# EAGLE design main (EAGLE 7.6.0)
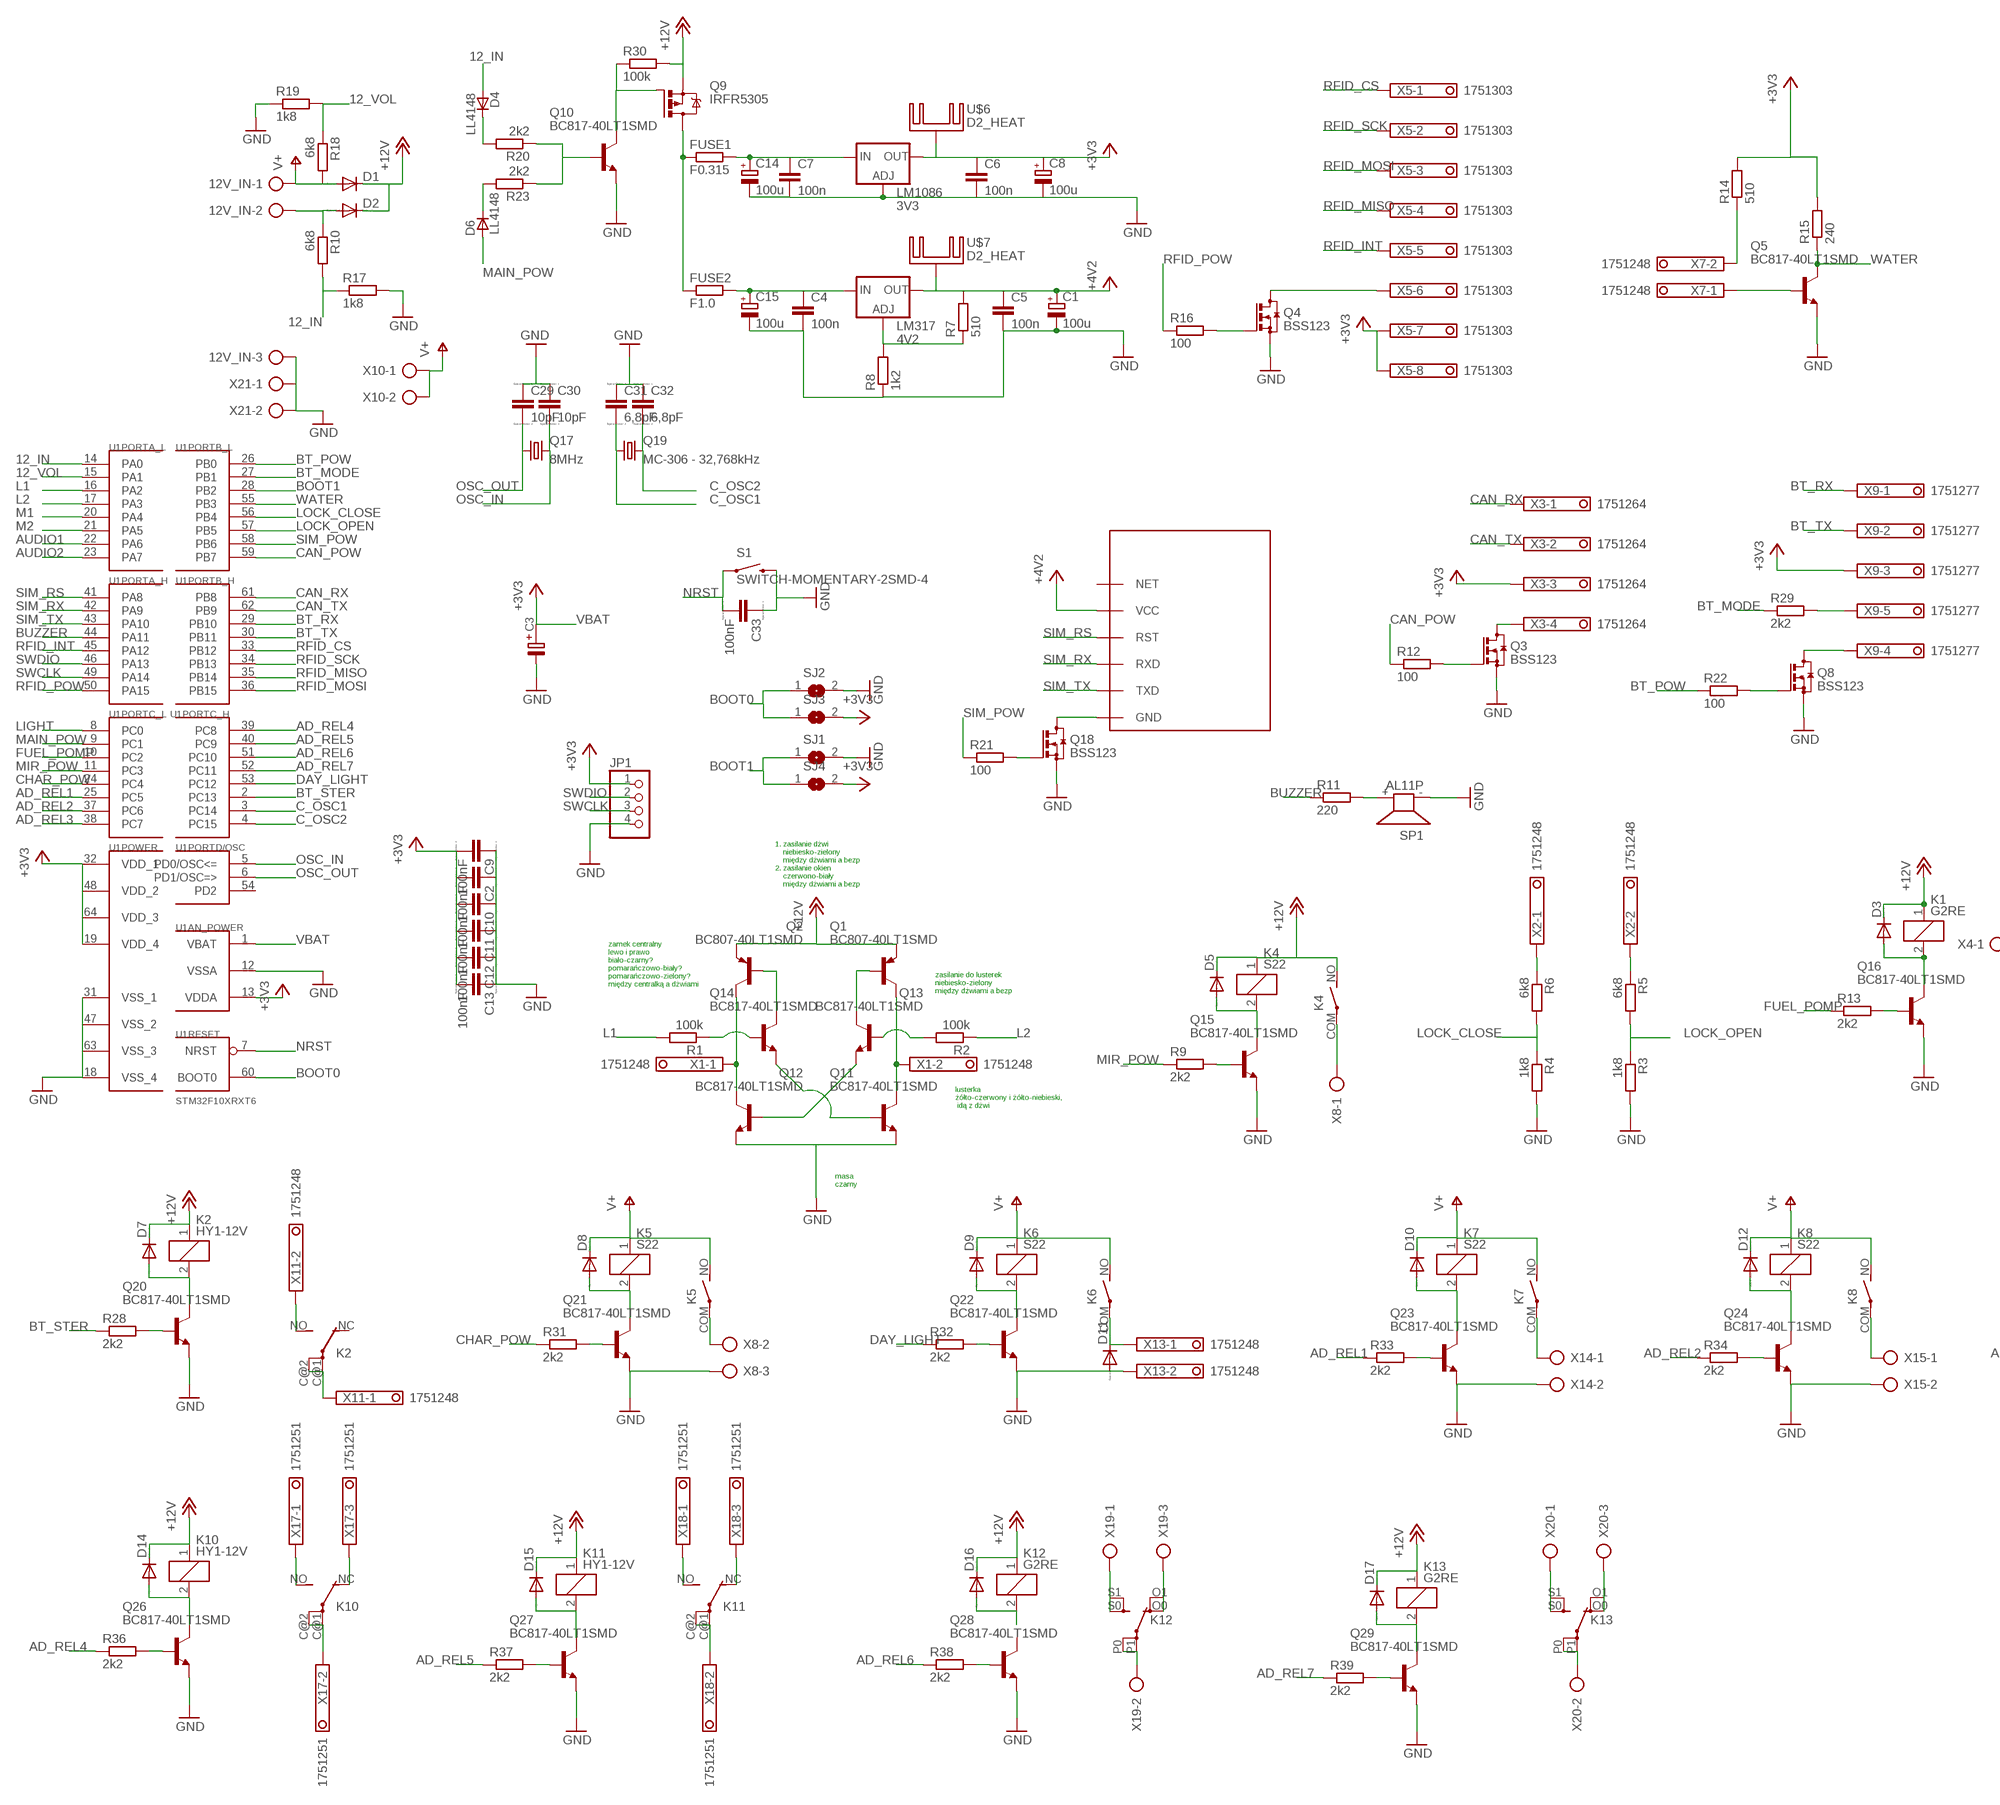
[diagram p0: schematic, sheet 1, part 1 of 2]
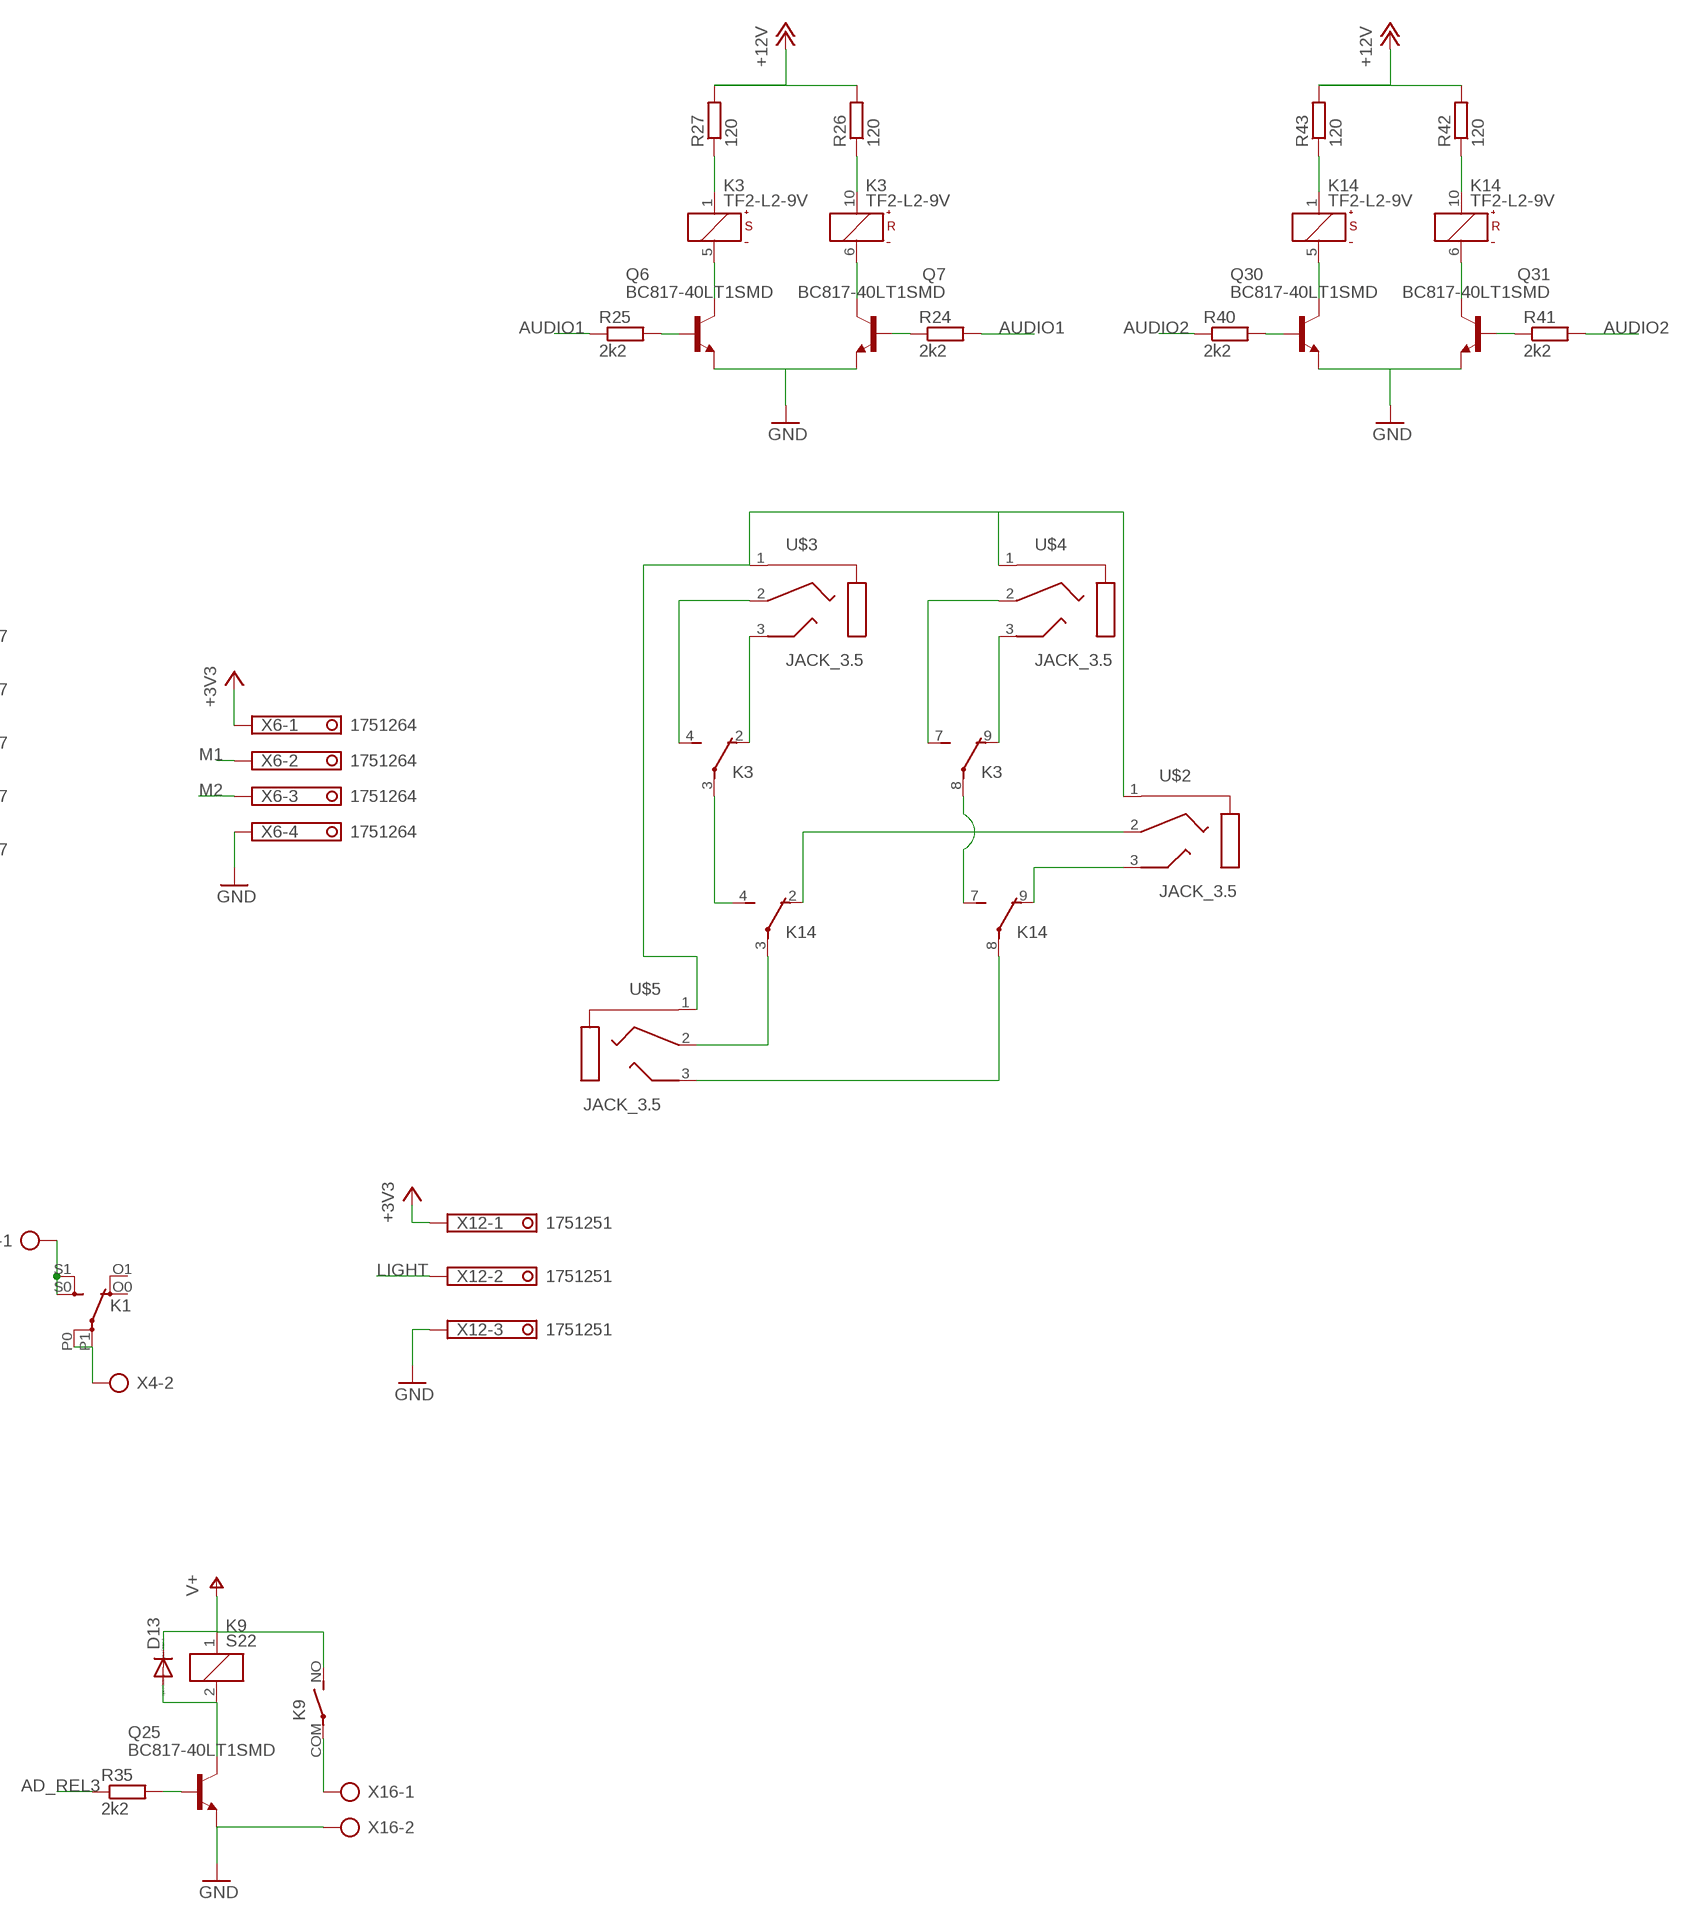
[diagram p1: schematic, sheet 1, part 2 of 2]

## Parts
12V_IN  AK500/3  [AK500/3]
C1  100u  CPOL-EUE2,5-6E  [E2,5-6E]
C2  100nF  CC2012  [C2012]
C3  CAP-13,5  [PAC-G-1]
C4  100n  C-EUC2012  [C2012]
C5  100n  C-EUC2012  [C2012]
C6  100n  C-EUC2012  [C2012]
C7  100n  C-EUC2012  [C2012]
C8  100u  CPOL-EUE2,5-6E  [E2,5-6E]
C9  100nF  CC2012  [C2012]
C10  100nF  CC2012  [C2012]
C11  100nF  CC2012  [C2012]
C12  100nF  CC2012  [C2012]
C13  100nF  CC2012  [C2012]
C14  100u  CPOL-EUE2,5-6E  [E2,5-6E]
C15  100u  CPOL-EUE2,5-6E  [E2,5-6E]
C29  10pF  CC2012  [C2012]
C30  10pF  CC2012  [C2012]
C31  6,8pF  CC2012  [C2012]
C32  6,8pF  CC2012  [C2012]
C33  100nF  CC2012  [C2012]
D1  DIODE-P6-15  [P6-15]
D2  DIODE-P6-15  [P6-15]
D3  DIODE-DO-214AC  [DO-214AC]
D4  LL4148  [SOD80_DO213AA_MINIMELF]
D5  DIODE-DO-214AC  [DO-214AC]
D6  LL4148  [SOD80_DO213AA_MINIMELF]
D7  DIODE-DO-214AC  [DO-214AC]
D8  DIODE-DO-214AC  [DO-214AC]
D9  DIODE-DO-214AC  [DO-214AC]
D10  DIODE-DO-214AC  [DO-214AC]
D11  DIODE-DO-214AC  [DO-214AC]
D12  DIODE-DO-214AC  [DO-214AC]
D13  DIODE-DO-214AC  [DO-214AC]
D14  DIODE-DO-214AC  [DO-214AC]
D15  DIODE-DO-214AC  [DO-214AC]
D16  DIODE-DO-214AC  [DO-214AC]
D17  DIODE-DO-214AC  [DO-214AC]
FUSE1  F0.315  R-EU_R2512  [R2512]
FUSE2  F1.0  R-EU_R2512  [R2512]
JP1  PINHD-1X4  [1X04]
K1  G2RE  [G2RE]
K2  HY1-12V  [HY]
K3  TF2-L2-9V  [TF2]
K4  S22  [LD]
K5  S22  [LD]
K6  S22  [LD]
K7  S22  [LD]
K8  S22  [LD]
K9  S22  [LD]
K10  HY1-12V  [HY]
K11  HY1-12V  [HY]
K12  G2RE  [G2RE]
K13  G2RE  [G2RE]
K14  TF2-L2-9V  [TF2]
LM317  4V2  LM317BD2T  [D2PACK]
LM1086  3V3  LM317BD2T  [D2PACK]
Q1  BC807-40LT1SMD  [SOT23-BEC]
Q2  BC807-40LT1SMD  [SOT23-BEC]
Q3  BSS123  [SOT23]
Q4  BSS123  [SOT23]
Q5  BC817-40LT1SMD  [SOT23-BEC]
Q6  BC817-40LT1SMD  [SOT23-BEC]
Q7  BC817-40LT1SMD  [SOT23-BEC]
Q8  BSS123  [SOT23]
Q9  IRFR5305  [D-PAK_TO252AA]
Q10  BC817-40LT1SMD  [SOT23-BEC]
Q11  BC817-40LT1SMD  [SOT23-BEC]
Q12  BC817-40LT1SMD  [SOT23-BEC]
Q13  BC817-40LT1SMD  [SOT23-BEC]
Q14  BC817-40LT1SMD  [SOT23-BEC]
Q15  BC817-40LT1SMD  [SOT23-BEC]
Q16  BC817-40LT1SMD  [SOT23-BEC]
Q17  8MHz  CRYSTALHC49UP  [HC49UP]
Q18  BSS123  [SOT23]
Q19  MC-306 - 32,768kHz  MC-306  [MC-306]
Q20  BC817-40LT1SMD  [SOT23-BEC]
Q21  BC817-40LT1SMD  [SOT23-BEC]
Q22  BC817-40LT1SMD  [SOT23-BEC]
Q23  BC817-40LT1SMD  [SOT23-BEC]
Q24  BC817-40LT1SMD  [SOT23-BEC]
Q25  BC817-40LT1SMD  [SOT23-BEC]
Q26  BC817-40LT1SMD  [SOT23-BEC]
Q27  BC817-40LT1SMD  [SOT23-BEC]
Q28  BC817-40LT1SMD  [SOT23-BEC]
Q29  BC817-40LT1SMD  [SOT23-BEC]
Q30  BC817-40LT1SMD  [SOT23-BEC]
Q31  BC817-40LT1SMD  [SOT23-BEC]
R1  100k  R-EU_R0805  [R0805]
R2  100k  R-EU_R0805  [R0805]
R3  1k8  R-EU_R0805  [R0805]
R4  1k8  R-EU_R0805  [R0805]
R5  6k8  R-EU_R0805  [R0805]
R6  6k8  R-EU_R0805  [R0805]
R7  510  R-EU_0204/7  [0204/7]
R8  1k2  R-EU_0204/7  [0204/7]
R9  2k2  R-EU_R0805  [R0805]
R10  6k8  R-EU_R0805  [R0805]
R11  220  R-EU_0204/7  [0204/7]
R12  100  R-EU_R0805  [R0805]
R13  2k2  R-EU_R0805  [R0805]
R14  510  R-EU_R0805  [R0805]
R15  240  R-EU_R0805  [R0805]
R16  100  R-EU_R0805  [R0805]
R17  1k8  R-EU_R0805  [R0805]
R18  6k8  R-EU_R0805  [R0805]
R19  1k8  R-EU_R0805  [R0805]
R20  2k2  R-EU_R0805  [R0805]
R21  100  R-EU_R0805  [R0805]
R22  100  R-EU_R0805  [R0805]
R23  2k2  R-EU_R0805  [R0805]
R24  2k2  R-EU_R0805  [R0805]
R25  2k2  R-EU_R0805  [R0805]
R26  120  R-EU_R0805  [R0805]
R27  120  R-EU_R0805  [R0805]
R28  2k2  R-EU_R0805  [R0805]
R29  2k2  R-EU_R0805  [R0805]
R30  100k  R-EU_R0805  [R0805]
R31  2k2  R-EU_R0805  [R0805]
R32  2k2  R-EU_R0805  [R0805]
R33  2k2  R-EU_R0805  [R0805]
R34  2k2  R-EU_R0805  [R0805]
R35  2k2  R-EU_R0805  [R0805]
R36  2k2  R-EU_R0805  [R0805]
R37  2k2  R-EU_R0805  [R0805]
R38  2k2  R-EU_R0805  [R0805]
R39  2k2  R-EU_R0805  [R0805]
R40  2k2  R-EU_R0805  [R0805]
R41  2k2  R-EU_R0805  [R0805]
R42  120  R-EU_R0805  [R0805]
R43  120  R-EU_R0805  [R0805]
S1  SWITCH-MOMENTARY-2SMD-4  [TACTILE_SWITCH_TALL]
SJ1  SJ  [SJ]
SJ2  SJ  [SJ]
SJ3  SJ  [SJ]
SJ4  SJ  [SJ]
SP1  AL11P  [AL11P]
U1  STM32F10XRXT6  [TQFP64]
U$1  SIM800L  [SIM-CORE]
U$2  JACK_3.5  [STX3100]
U$3  JACK_3.5  [STX3100]
U$4  JACK_3.5  [STX3100]
U$5  JACK_3.5  [STX3100]
U$6  D2_HEAT  [D2PACK_HEATSINK]
U$7  D2_HEAT  [D2PACK_HEATSINK]
X1  1751248  [1751248]
X2  1751248  [1751248]
X3  1751264  [1751264]
X4  AK500/2  [AK500/2]
X5  1751303  [1751303]
X6  1751264  [1751264]
X7  1751248  [1751248]
X8  AK500/3  [AK500/3]
X9  1751277  [1751277]
X10  AK500/2  [AK500/2]
X11  1751248  [1751248]
X12  1751251  [1751251]
X13  1751248  [1751248]
X14  AK500/2  [AK500/2]
X15  AK500/2  [AK500/2]
X16  AK500/2  [AK500/2]
X17  1751251  [1751251]
X18  1751251  [1751251]
X19  AK500/3  [AK500/3]
X20  AK500/3  [AK500/3]
X21  AK500/2  [AK500/2]

## Nets
4V2: U$1.VCC ; supply symbol labelled +4V2
12_IN: D4.A R10.2 R17.1 U1.14(PORTA_L:PA0)
12_VOL: R18.1 R19.2 U1.15(PORTA_L:PA1)
+3V3: C2.2 C6.1 C8.+ C9.2 C10.2 C11.2 C12.2 C13.2 JP1.1 LM1086.2(OUT) R14.2 R15.2 SJ3.2 SJ4.2 U1.13(AN_POWER:VDDA) U1.19(POWER:VDD_4) U1.32(POWER:VDD_1) U1.48(POWER:VDD_2) U1.64(POWER:VDD_3) U$6.1(K) X3.3 X5.7 X5.8 X6.1 X9.3 X12.1
+12V: D1.C D2.C D3.C D5.C D7.C D14.C D15.C D16.C D17.C K1.1 K2.1 K4.1 K4.NO(S) K10.1 K11.1 K12.1 K13.1 Q1.E Q2.E Q9.3(S) R26.2 R27.2 R30.2 R42.2 R43.2
AD_REL1: R33.1 U1.25(PORTC_L:PC5)
AD_REL2: R34.1 U1.37(PORTC_L:PC6)
AD_REL3: R35.1 U1.38(PORTC_L:PC7)
AD_REL4: R36.1 U1.39(PORTC_H:PC8)
AD_REL5: R37.1 U1.40(PORTC_H:PC9)
AD_REL6: R38.1 U1.51(PORTC_H:PC10)
AD_REL7: R39.1 U1.52(PORTC_H:PC11)
AUDIO1: R24.2 R25.1 U1.22(PORTA_L:PA6)
AUDIO2: R40.1 R41.2 U1.23(PORTA_L:PA7)
BOOT0: SJ2.1 SJ3.1 U1.60(RESET:BOOT0)
BOOT1: SJ1.1 SJ4.1 U1.28(PORTB_L:PB2)
BT_MODE: R29.1 U1.27(PORTB_L:PB1)
BT_POW: R22.1 U1.26(PORTB_L:PB0)
BT_RX: U1.29(PORTB_H:PB10) X9.1
BT_STER: R28.1 U1.2(PORTC_H:PC13)
BT_TX: U1.30(PORTB_H:PB11) X9.2
BUZZER: R11.1 U1.44(PORTA_H:PA11)
C_OSC1: C31.2 Q19.1 U1.3(PORTC_H:PC14)
C_OSC2: C32.2 Q19.4 U1.4(PORTC_H:PC15)
CAN_POW: R12.1 U1.59(PORTB_L:PB7)
CAN_RX: U1.61(PORTB_H:PB8) X3.1
CAN_TX: U1.62(PORTB_H:PB9) X3.2
CHAR_POW: R31.1 U1.24(PORTC_L:PC4)
DAY_LIGHT: R32.1 U1.53(PORTC_H:PC12)
FUEL_POMP: R13.1 U1.10(PORTC_L:PC2)
GND: 12V_IN.3 C1.- C2.1 C3.- C4.2 C5.2 C6.2 C7.2 C8.- C9.1 C10.1 C11.1 C12.1 C13.1 C14.- C15.- C29.1 C30.1 C31.1 C32.1 C33.1 D11.A JP1.4 LM1086.1(ADJ) Q3.2(S) Q4.2(S) Q5.E Q6.E Q7.E Q8.2(S) Q10.E Q11.E Q12.E Q15.E Q16.E Q18.2(S) Q20.E Q21.E Q22.E Q23.E Q24.E Q25.E Q26.E Q27.E Q28.E Q29.E Q30.E Q31.E R3.2 R4.2 R8.1 R17.2 R19.1 S1.B2 SJ1.2 SJ2.2 SP1.- U1.12(AN_POWER:VSSA) U1.18(POWER:VSS_4) U1.31(POWER:VSS_1) U1.47(POWER:VSS_2) U1.63(POWER:VSS_3) X6.4 X8.3 X12.3 X13.2 X14.2 X15.2 X16.2 X21.1 X21.2
L1: R1.2 U1.16(PORTA_L:PA2)
L2: R2.1 U1.17(PORTA_L:PA3)
LIGHT: U1.8(PORTC_L:PC0) X12.2
LOCK_CLOSE: R4.1 R6.2 U1.56(PORTB_L:PB4)
LOCK_OPEN: R3.1 R5.2 U1.57(PORTB_L:PB5)
M1: U1.20(PORTA_L:PA4) X6.2
M2: U1.21(PORTA_L:PA5) X6.3
MAIN_POW: D6.A U1.9(PORTC_L:PC1)
MIR_POW: R9.1 U1.11(PORTC_L:PC3)
N$2: 12V_IN.2 D2.A R10.1
N$3: R6.1 X2.1
N$4: Q1.C Q11.C X1.2
N$5: Q2.C Q12.C X1.1
N$6: R5.1 X2.2
N$7: Q2.B Q14.C
N$8: Q1.B Q13.C
N$9: Q12.B Q13.E
N$10: D4.C R20.2
N$11: R11.2 SP1.+
N$12: Q3.1(G) R12.2
N$13: Q8.1(G) R22.2
N$14: LM317.1(ADJ) R7.1 R8.2
N$15: Q3.3(D) X3.4
N$16: D3.A K1.2 Q16.C
N$17: Q16.B R13.2
N$18: K1.S0(2:S) K1.S1(2:S) X4.1
N$19: K1.P0(2:P) K1.P1(2:P) X4.2
N$20: R14.1 X7.2
N$21: Q4.3(D) X5.6
N$22: K14.1(S:+) R43.1
N$23: Q14.B R1.1
N$24: Q5.B X7.1
N$25: Q13.B R2.2
N$26: Q11.B Q14.E
N$27: Q4.1(G) R16.2
N$28: Q15.B R9.2
N$29: D5.A K4.2 Q15.C
N$30: K14.10(R:+) R42.1
N$31: K14.5(S:-) Q30.C
N$32: K14.6(R:-) Q31.C
N$33: Q30.B R40.2
N$34: K3.1(S:+) R27.1
N$35: K3.10(R:+) R26.1
N$36: K3.5(S:-) Q6.C
N$37: K3.6(R:-) Q7.C
N$38: Q6.B R25.2
N$39: Q8.3(D) X9.4
N$40: FUSE1.1 FUSE2.1 Q9.4(D)
N$41: Q7.B R24.1
N$42: R29.2 X9.5
N$43: Q10.B R20.1 R23.1
N$44: Q9.1(G) Q10.C R30.1
N$45: D6.C R23.2
N$46: C7.1 C14.+ FUSE1.2 LM1086.3(IN)
N$47: Q18.3(D) U$1.GND
N$48: K4.COM(P) X8.1
N$49: C4.1 C15.+ FUSE2.2 LM317.3(IN)
N$50: Q31.B R41.1
N$51: Q18.1(G) R21.2
N$52: D7.A K2.2 Q20.C
N$53: Q20.B R28.2
N$54: D11.C K6.COM(P) X13.1
N$55: Q26.B R36.2
N$56: D8.A K5.2 Q21.C
N$57: K2.NO(2:S) X11.2
N$58: K2.C@1(2:P) K2.C@2(2:P) X11.1
N$59: Q21.B R31.2
N$60: D9.A K6.2 Q22.C
N$61: Q22.B R32.2
N$62: D10.A K7.2 Q23.C
N$63: Q23.B R33.2
N$64: K5.COM(P) X8.2
N$65: K7.COM(P) X14.1
N$66: D14.A K10.2 Q26.C
N$67: D12.A K8.2 Q24.C
N$68: Q24.B R34.2
N$69: K8.COM(P) X15.1
N$70: Q27.B R37.2
N$71: D13.A K9.2 Q25.C
N$72: Q25.B R35.2
N$73: K9.COM(P) X16.1
N$74: D15.A K11.2 Q27.C
N$75: Q28.B R38.2
N$76: K10.NO(2:S) X17.1
N$77: Q29.B R39.2
N$78: D17.A K13.2 Q29.C
N$79: K10.NC(2:O) X17.3
N$80: D16.A K12.2
N$81: K10.C@1(2:P) K10.C@2(2:P) X17.2
N$82: K11.NO(2:S) X18.1
N$83: K11.NC(2:O) X18.3
N$84: K11.C@1(2:P) K11.C@2(2:P) X18.2
N$85: K12.S0(2:S) K12.S1(2:S) X19.1
N$86: K12.O0(2:O) K12.O1(2:O) X19.3
N$87: K12.P0(2:P) K12.P1(2:P) X19.2
N$88: K13.S0(2:S) K13.S1(2:S) X20.1
N$89: K13.O0(2:O) K13.O1(2:O) X20.3
N$90: K13.P0(2:P) K13.P1(2:P) X20.2
N$91: K14.2(1:O) U$2.2
N$92: K14.9(2:O) U$2.3
N$93: K3.8(2:P) K14.7(2:S)
N$94: K3.3(1:P) K14.4(1:S)
N$95: K3.4(1:S) U$3.2
N$96: K3.2(1:O) U$3.3
N$97: K3.7(2:S) U$4.2
N$98: K3.9(2:O) U$4.3
N$99: U$2.1 U$3.1 U$4.1 U$5.1
N$100: K14.3(1:P) U$5.2
N$101: K14.8(2:P) U$5.3
NRST: C33.2 S1.A2 U1.7(RESET:NRST)
OSC_IN: C30.2 Q17.2 U1.5(PORTD/OSC:PD0/OSC<=)
OSC_OUT: C29.2 Q17.1 U1.6(PORTD/OSC:PD1/OSC=>)
RFID_CS: U1.33(PORTB_H:PB12) X5.1
RFID_INT: U1.45(PORTA_H:PA12) X5.5
RFID_MISO: U1.35(PORTB_H:PB14) X5.4
RFID_MOSI: U1.36(PORTB_H:PB15) X5.3
RFID_POW: R16.1 U1.50(PORTA_H:PA15)
RFID_SCK: U1.34(PORTB_H:PB13) X5.2
SIM_POW: R21.1 U1.58(PORTB_L:PB6)
SIM_RS: U1.41(PORTA_H:PA8) U$1.RST
SIM_RX: U1.42(PORTA_H:PA9) U$1.RXD
SIM_TX: U1.43(PORTA_H:PA10) U$1.TXD
SWCLK: JP1.3 U1.49(PORTA_H:PA14)
SWDIO: JP1.2 U1.46(PORTA_H:PA13)
V+: 12V_IN.1 D1.A D8.C D9.C D10.C D12.C D13.C K5.1 K5.NO(S) K6.1 K6.NO(S) K7.1 K7.NO(S) K8.1 K8.NO(S) K9.1 K9.NO(S) R18.2 X10.1 X10.2
VBAT: C3.+ U1.1(AN_POWER:VBAT) ; supply symbol labelled +3V3
VCC: C1.+ C5.1 LM317.2(OUT) R7.2 U$7.1(K) ; supply symbol labelled +4V2
WATER: Q5.C R15.1 U1.55(PORTB_L:PB3)
Unconnected: K1.O0(2:O) K1.O1(2:O) K2.NC(2:O) Q28.C U1.54(PORTD/OSC:PD2) U$1.NET

## Notes on the sheet
- 1. zasilanie dżwi
      niebiesko-zielony
      między dżwiami a bezp
  2. zasilanie okien
      czerwono-biały
      między dżwiami a bezp
- zamek centralny
  lewo i prawo
  biało-czarny?
  pomarańczowo-biały?
  pomarańczowo-zielony?
  między centralką a dżwiami
- zasilanie do lusterek
  niebiesko-zielony
  między dżwiami a bezp
- lusterka
  żółto-czerwony i żółto-niebieski,
   idą z dżwi
- masa
  czarny

## Library data of the parts
12V_IN X8 X19 X20 = con-ptr500:AK500/3: CONNECTOR; OC_FARNELL: unknown; OC_NEWARK: unknown
C1 C8 C14 C15 = resistor:CPOL-EU: POLARIZED CAPACITOR, European symbol
C2 C9-C13 C29-C33 = eagle-ltspice:C: CAPACITOR, European symbol; SPICEMODEL: NONE; SPICEPREFIX: C
C3 = Cap-Gold:CAP-13,5
C4-C7 = resistor:C-EU: CAPACITOR, European symbol
D1-D3 D5 D7-D17 = diode:DIODE-: DIODE
D4 D6 = _hhn_diodes_smd:LL4148: 1N4148 General Purpose Rectifie SMD-Version of 1N4148 Case: SOD 80 = DO 213 AA = MINIMELF (Glass) Author: Dipl.-Ing. FH Rainer Bayer HHN Hochschule Heilbronn, rainer.bayer@hs-heilbronn.de Ingenieurbüro ing-rb, mail@ing-rb.de
FUSE1 FUSE2 R1-R43 = resistor:R-EU_: RESISTOR, European symbol
JP1 = pinhead:PINHD-1X4: PIN HEADER
K1 K12 K13 = relay:G2RE: RELAY 1 x switch, high current, Omron; OC_FARNELL: unknown; OC_NEWARK: unknown
K2 K10 K11 = relay:HY1*: Non-polarized 1 Form C Relay NAiS Source: http://www.mew-europe.com/.. en_ds_61012_0000.pdf; MF: AROMAT/ MATSUSHITA; MPN: HY1-12V; OC_FARNELL: unknown; OC_NEWARK: 10C6688
K3 K14 = relay:TF2-L2*: SMALL POLARIZED RELAY WITH HIGH SENSITIVITY NAiS 2 coil latching Source: http://www.mew-europe.com/.. en_ds_61017_0000.pdf; OC_FARNELL: unknown; OC_NEWARK: unknown
K4-K9 = Stworzone:S22
LM317 LM1086 = v-reg:LM317?*: 500 mA Adjustable Output Positive Voltage Regulator Source: http://www.onsemi.co.jp .. LM317M-D.PDF
Q1 Q2 = transistor-pnp:BC807*: PNP Transistror
Q3 Q4 Q8 Q18 = transistor-small-signal:BSS123: N-CHANNEL MOS FET
Q5-Q7 Q10-Q16 Q20-Q31 = transistor-npn:BC817*: NPN Transistor
Q9 = transistor-power:IRF?5305: HEXFET Power MOSFET Source: http://www.irf.com/product-info/datasheets/data/irfr5305pbf.pdf
Q17 = crystal:CRYSTAL: CRYSTAL; OC_FARNELL: unknown; OC_NEWARK: unknown
Q19 = crystal:MC-306: kHz RANGE CRYSTAL UNIT SMD Source: MC-306_405_406_E07X.PDF Homepage; MPN: MC-306 60.0KHZ 100PPM ,12.5PF; OC_FARNELL: 1278040; OC_NEWARK: 31M5576
S1 = SparkFun-Electromechanical:SWITCH-MOMENTARY-2: Various NO switches- pushbuttons, reed, etc; PROD_ID: SWCH-11966
SJ1-SJ4 = jumper:SJ: SMD solder JUMPER
SP1 = buzzer:AL11P: SPEAKER Source: Buerklin; OC_FARNELL: unknown; OC_NEWARK: unknown
U1 = stm32:STM32F10XRXT6: STM32F101/103 64pin LQFP
U$1 = SIM800L:SIM800L
U$2-U$5 = Stworzone:JACK_3.5
U$6 U$7 = Stworzone:D2_HEAT
X1 X2 X7 X11 X13 = con-phoenix-350:1751248: MKDS 1/ 2-3,5 Printklemme Nennstrom: 10 A Bemessungsspannung: 160 V Raster: 3,5 mm Polzahl: 2 Montageart: Löten Anschlussart: Schraubanschluss Anschlussrichtung vom Leiter zur Platine: 0° Source: http://eshop.phoenixcontact.com .. 1751248.pdf; OC_FARNELL: unknown; OC_NEWARK: unknown
X3 X6 = con-phoenix-350:1751264: MKDS 1/ 4-3,5 Printklemme Nennstrom: 10 A Bemessungsspannung: 160 V Raster: 3,5 mm Polzahl: 4 Montageart: Löten Anschlussart: Schraubanschluss Anschlussrichtung vom Leiter zur Platine: 0° Source: http://eshop.phoenixcontact.com .. 1751264.pdf; MPN: 1751264; OC_FARNELL: unknown; OC_NEWARK: 10R0934
X4 X10 X14-X16 X21 = con-ptr500:AK500/2: CONNECTOR; OC_FARNELL: unknown; OC_NEWARK: unknown
X5 = con-phoenix-350:1751303: MKDS 1/ 8-3,5 Printklemme Nennstrom: 10 A Bemessungsspannung: 160 V Raster: 3,5 mm Polzahl: 8 Montageart: Löten Anschlussart: Schraubanschluss Anschlussrichtung vom Leiter zur Platine: 0° Source: http://eshop.phoenixcontact.com .. .pdf; OC_FARNELL: unknown; OC_NEWARK: unknown
X9 = con-phoenix-350:1751277: MKDS 1/ 5-3,5 Printklemme Nennstrom: 10 A Bemessungsspannung: 160 V Raster: 3,5 mm Polzahl: 5 Montageart: Löten Anschlussart: Schraubanschluss Anschlussrichtung vom Leiter zur Platine: 0° Source: http://eshop.phoenixcontact.com .. 1751277.pdf; OC_FARNELL: unknown; OC_NEWARK: unknown
X12 X17 X18 = con-phoenix-350:1751251: MKDS 1/ 3-3,5 Printklemme Nennstrom: 10 A Bemessungsspannung: 160 V Raster: 3,5 mm Polzahl: 3 Montageart: Löten Anschlussart: Schraubanschluss Anschlussrichtung vom Leiter zur Platine: 0° Source: http://eshop.phoenixcontact.com .. 1751251.pdf; OC_FARNELL: unknown; OC_NEWARK: unknown

## Board
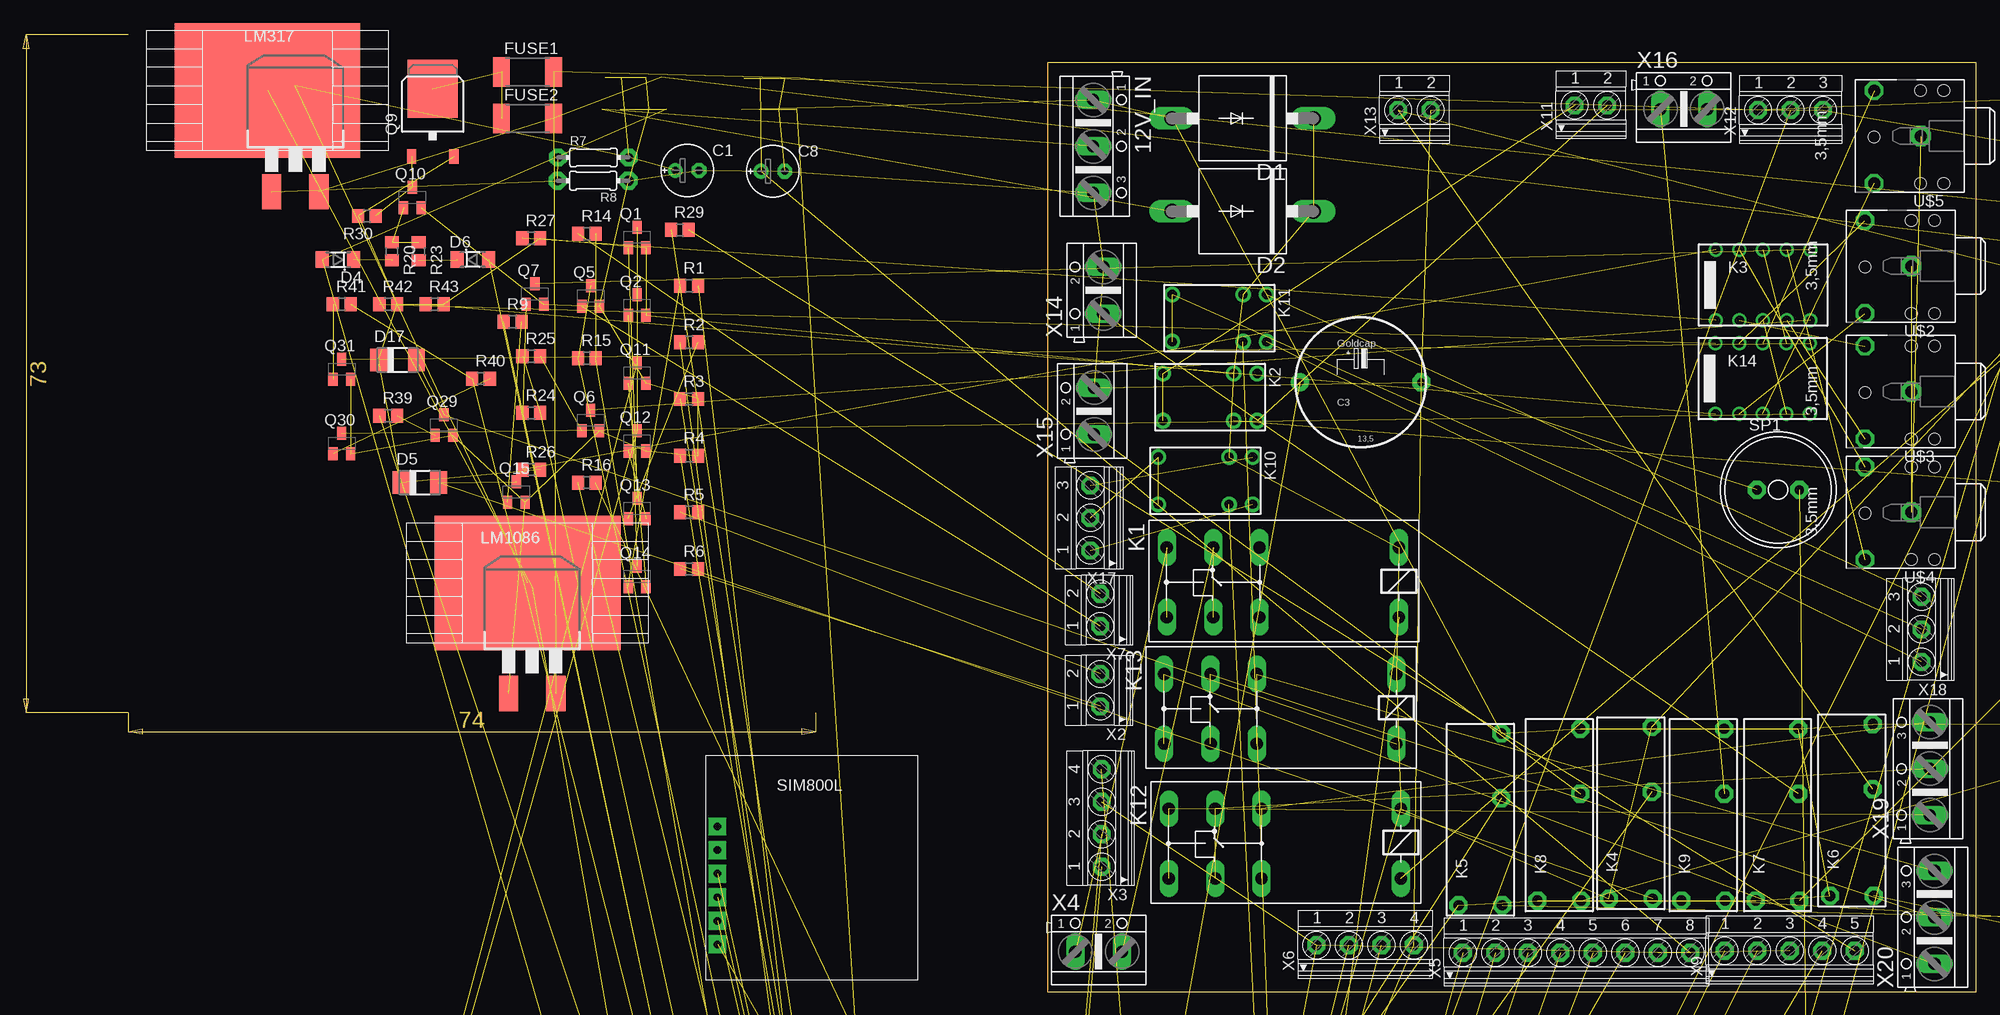
[diagram p2: board, top side]
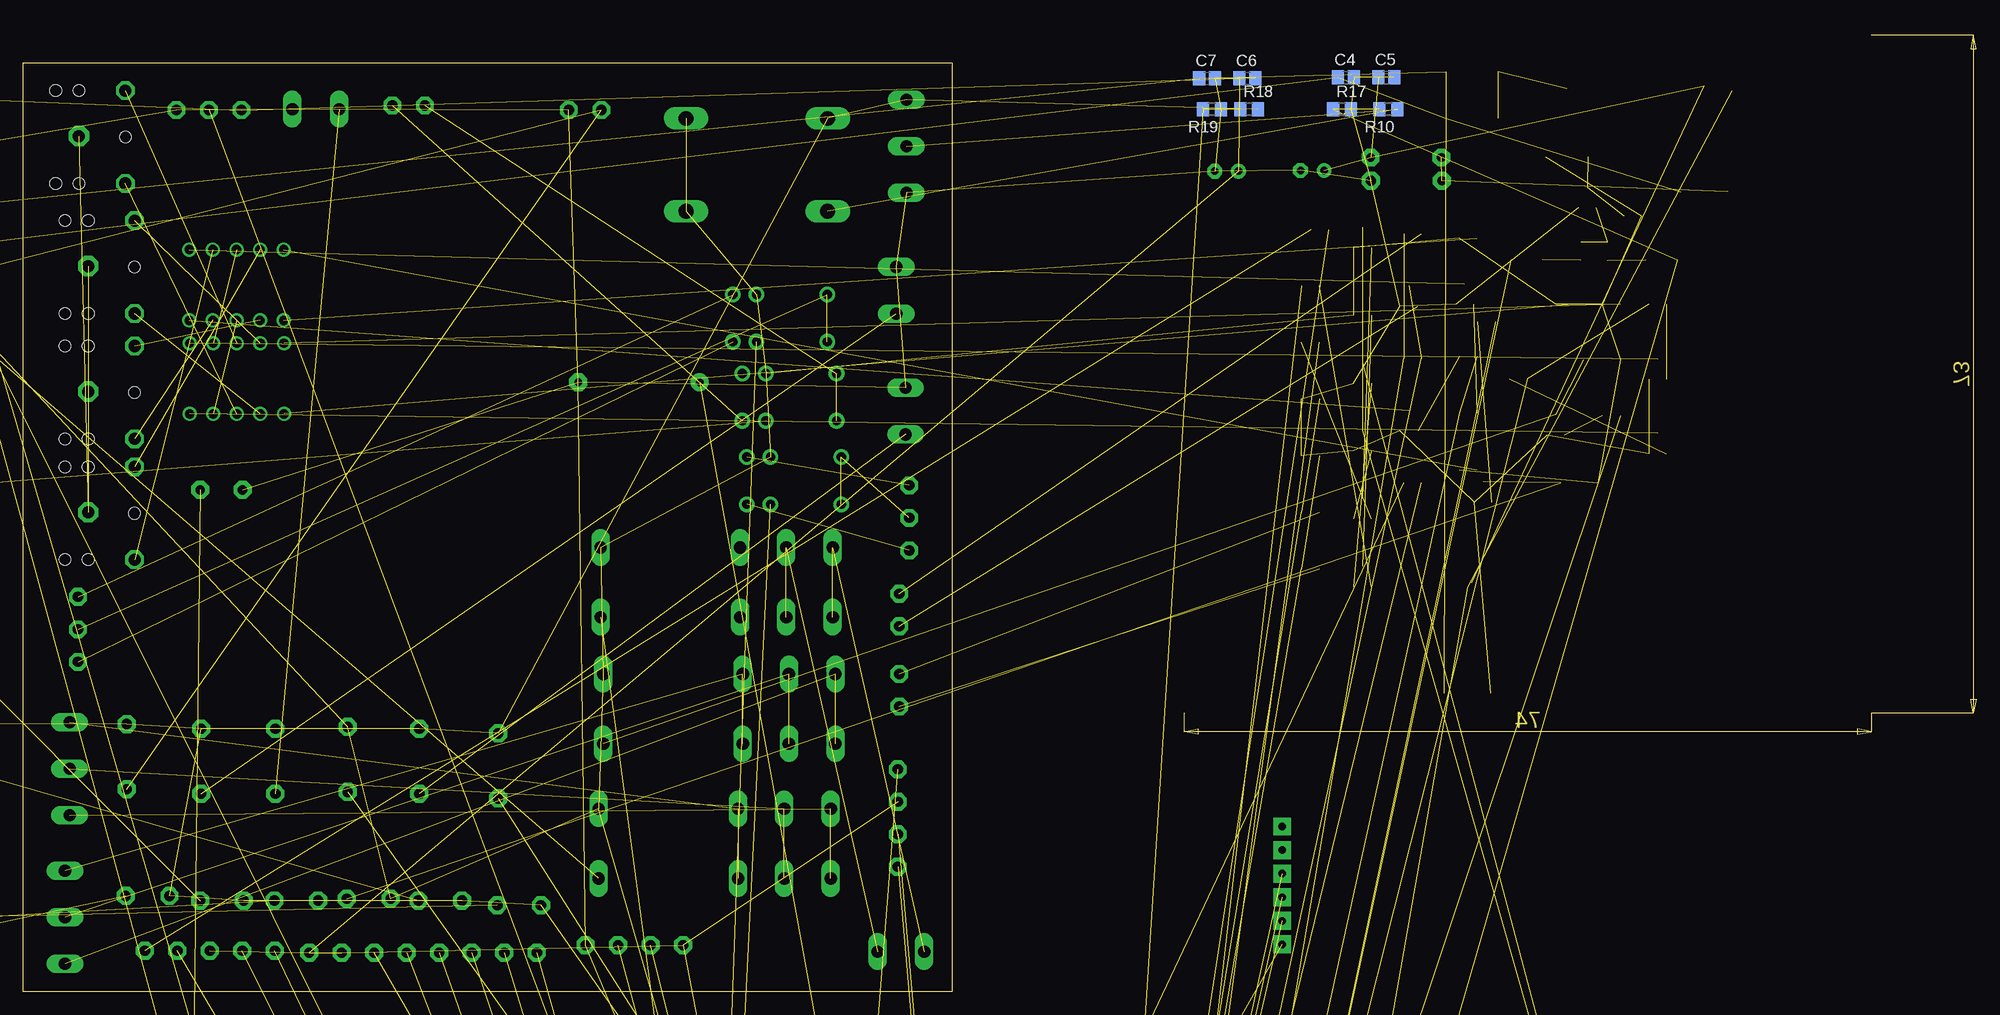
[diagram p3: board, bottom side, seen from below]

Size 210.3 x 103 mm. Coordinates in mm from the lower left corner, seen from the top.
Outline: 110.3,0 210.3,0 210.3,100 110.3,100 110.3,0
Copper layers (1*16): Top 0.035mm / dielectric 1.5mm / Bottom 0.035mm
Design rules "default": minimum track width 10mil, minimum drill 24mil, track to track 8mil, track to pad 8mil, pad to pad 8mil, via to via 8mil, smd to smd 8mil, copper to edge 40mil, drill to drill 8mil, minimum pad ring 10mil, minimum via ring 8mil, stop-mask expansion 4mil, vias tented up to drill 0mil, thermal gap 10mil

### Footprints (pad centres in the part's own frame; a part is rotated, then mirrored left to right if it is on the bottom)
AK500/3 = drill 1.321 long: 1 -5.004,0; 2 0,0; 3 5.004,0
E2,5-6E = drill 0.813 pad 1.575: + -1.27,0 | drill 0.813 pad 1.575 octagon: - 1.27,0
C2012 = smd 1.3 x 1.5: 1 -0.85,0; 2 0.85,0
PAC-G-1 = drill 0.813 pad 1.93: + -6.54,0 | drill 0.813 pad 1.93 octagon: - 6.54,0
P6-15 = drill 1.6 long: A 7.62,0; C -7.62,0
DO-214AC = smd 1.8 x 2.4: A 2.025,0; C -2.025,0
SOD80_DO213AA_MINIMELF = smd 1.4 x 1.8: A 1.7,0; C -1.7,0
R2512 = smd 1.8 x 3.2: 1 -2.8,0; 2 2.8,0
1X04 = drill 1.016 long: 1 -3.81,0; 2 -1.27,0; 3 1.27,0; 4 3.81,0
G2RE = drill 1.321 long: 1 -2.54,-3.683; 2 -2.54,3.81; O0 12.471,-3.683; O1 12.471,3.81; P0 17.45,-3.683; P1 17.45,3.81; S0 22.454,-3.683; S1 22.454,3.81
HY = drill 1 pad 1.676: 1 -2.54,-2.54; 2 -2.54,2.54; C@1 5.08,2.54; C@2 5.08,-2.54; NC -5.08,-2.54; NO -5.08,2.54
TF2 = drill 1: 1 -5.08,-3.81; 2 -2.54,-3.81; 3 0,-3.81; 4 2.54,-3.81; 5 5.08,-3.81; 6 5.08,3.81; 7 2.54,3.81; 8 0,3.81; 9 -2.54,3.81; 10 -5.08,3.81
LD = drill 1.1 pad 1.93 octagon: 1 -9.2,2.25; 2 -9.2,-2.45; COM 2.3,-2.35; NO 9.3,-2.35
D2PACK = smd 2.083 x 3.81: 1 -2.54,-8.89; 3 2.54,-8.89 | smd 11.43 x 8.89: 2 0,2.54
SOT23-BEC = smd 1 x 1.4: B -0.95,-1.1; C 0,1.1; E 0.95,-1.1
SOT23 = smd 1 x 1.4: 1 -0.95,-1.1; 2 0.95,-1.1; 3 0,1.1
D-PAK_TO252AA = smd 1 x 1.6: 1 -2.28,-4.8; 3 2.28,-4.8 | smd 5.4 x 6.2: 4 0,2.5
HC49UP = smd 5.334 x 1.93: 1 -4.826,0; 2 4.826,0
MC-306 = smd 1.3 x 1.9: 1 -2.75,-1.6; 2 2.75,-1.6; 3 2.75,1.6; 4 -2.75,1.6
R0805 = smd 1.3 x 1.5: 1 -0.95,0; 2 0.95,0
0204/7 = drill 0.94 pad 1.905 octagon: 1 -3.81,0; 2 3.81,0
TACTILE_SWITCH_TALL = smd 1.55 x 1.3: A1 -3.975,-2.25; A2 3.975,-2.25; B1 -3.975,2.25; B2 3.975,2.25
SJ = smd 1.168 x 1.6: 1 -0.762,0; 2 0.762,0
AL11P = drill 1.016 pad 1.905 octagon: + 2.286,0; - -2.286,0
TQFP64 = smd 1.2 x 0.3: 1 -5.7,3.75; 2 -5.7,3.25; 3 -5.7,2.75; 4 -5.7,2.25; 5 -5.7,1.75; 6 -5.7,1.25; 7 -5.7,0.75; 8 -5.7,0.25; 9 -5.7,-0.25; 10 -5.7,-0.75; 11 -5.7,-1.25; 12 -5.7,-1.75; 13 -5.7,-2.25; 14 -5.7,-2.75; 15 -5.7,-3.25; 16 -5.7,-3.75; 33 5.7,-3.75; 34 5.7,-3.25; 35 5.7,-2.75; 36 5.7,-2.25; 37 5.7,-1.75; 38 5.7,-1.25; 39 5.7,-0.75; 40 5.7,-0.25; 41 5.7,0.25; 42 5.7,0.75; 43 5.7,1.25; 44 5.7,1.75; 45 5.7,2.25; 46 5.7,2.75; 47 5.7,3.25; 48 5.7,3.75 | smd 0.3 x 1.2: 17 -3.75,-5.7; 18 -3.25,-5.7; 19 -2.75,-5.7; 20 -2.25,-5.7; 21 -1.75,-5.7; 22 -1.25,-5.7; 23 -0.75,-5.7; 24 -0.25,-5.7; 25 0.25,-5.7; 26 0.75,-5.7; 27 1.25,-5.7; 28 1.75,-5.7; 29 2.25,-5.7; 30 2.75,-5.7; 31 3.25,-5.7; 32 3.75,-5.7; 49 3.75,5.7; 50 3.25,5.7; 51 2.75,5.7; 52 2.25,5.7; 53 1.75,5.7; 54 1.25,5.7; 55 0.75,5.7; 56 0.25,5.7; 57 -0.25,5.7; 58 -0.75,5.7; 59 -1.25,5.7; 60 -1.75,5.7; 61 -2.25,5.7; 62 -2.75,5.7; 63 -3.25,5.7; 64 -3.75,5.7
SIM-CORE = drill 0.8 pad 1.93 square: GND 1.27,3.81; NET 1.27,16.51; RST 1.27,11.43; RXD 1.27,8.89; TXD 1.27,6.35; VCC 1.27,13.97
STX3100 = drill 1.3 pad 2.184 octagon: 1 4.5,-0.1 | drill 1.3 pad 2 octagon: 2 9.5,5; 3 9.5,-5 | hole 1.25: 9.5,0; 4.5,5; 4.5,-5; 2,-5; 2,5
D2PACK_HEATSINK = smd 20 x 14.5: 1 0,0
1751248 = drill 1.1 pad 1.905 octagon: 1 -1.75,-0.1; 2 1.75,-0.1
1751264 = drill 1.1 pad 1.93 octagon: 1 -5.25,-0.1; 2 -1.75,-0.1; 3 1.75,-0.1; 4 5.25,-0.1
AK500/2 = drill 1.321 long: 1 -2.515,0; 2 2.515,0
1751303 = drill 1.1 pad 1.93 octagon: 1 -12.25,-0.1; 2 -8.75,-0.1; 3 -5.25,-0.1; 4 -1.75,-0.1; 5 1.75,-0.1; 6 5.25,-0.1; 7 8.75,-0.1; 8 12.25,-0.1
1751277 = drill 1.1 pad 1.93 octagon: 1 -7,-0.1; 2 -3.5,-0.1; 3 0,-0.1; 4 3.5,-0.1; 5 7,-0.1
1751251 = drill 1.1 pad 1.905 octagon: 1 -3.5,-0.1; 2 0,-0.1; 3 3.5,-0.1

### Placement (x,y rotation side)
12V_IN  115.2,91 270 top
C1  71.5,88.4 0 top
C2  not placed on the board
C3  144,65.6 0 top
C4  67.87,98.42 0 bottom
C5  63.52,98.42 0 bottom
C6  78.47,98.32 0 bottom
C7  82.82,98.32 0 bottom
C8  80.72,88.32 0 top
C9  not placed on the board
C10  not placed on the board
C11  not placed on the board
C12  not placed on the board
C13  not placed on the board
C14  not placed on the board
C15  not placed on the board
C29  not placed on the board
C30  not placed on the board
C31  not placed on the board
C32  not placed on the board
C33  not placed on the board
D1  131.3,94 180 top
D2  131.3,84 180 top
D3  not placed on the board
D4  33.9,78.8 180 top
D5  42.7,54.8 0 top
D6  48.4,78.8 0 top
D7  not placed on the board
D8  not placed on the board
D9  not placed on the board
D10  not placed on the board
D11  not placed on the board
D12  not placed on the board
D13  not placed on the board
D14  not placed on the board
D15  not placed on the board
D16  not placed on the board
D17  40.3,68 0 top
FUSE1  54.3,99 0 top
FUSE2  54.3,94 0 top
JP1  not placed on the board
K1  145.59,44.12 180 top
K2  127.8,64 180 top
K3  187.34,76.07 0 top
K4  173,19.2 90 top
K5  156.8,18.5 90 top
K6  196.8,19.5 90 top
K7  188.8,19 90 top
K8  165.3,19 90 top
K9  180.8,19 90 top
K10  127.3,55 180 top
K11  128.8,72.5 180 top
K12  145.8,16 180 top
K13  145.3,30.5 180 top
K14  187.3,66 0 top
LM317  29.3,95 0 top
LM1086  54.8,41 0 top
Q1  66.1,81.2 0 top
Q2  66.1,73.9 0 top
Q3  not placed on the board
Q4  not placed on the board
Q5  61.1,74.9 0 top
Q6  61.1,61.5 0 top
Q7  55.1,75.1 0 top
Q8  not placed on the board
Q9  44.1,94.7 0 top
Q10  41.9,85.5 0 top
Q11  66.1,66.6 0 top
Q12  66.1,59.3 0 top
Q13  66.1,52 0 top
Q14  66.1,44.7 0 top
Q15  53.1,53.8 0 top
Q16  not placed on the board
Q17  not placed on the board
Q18  not placed on the board
Q19  not placed on the board
Q20  not placed on the board
Q21  not placed on the board
Q22  not placed on the board
Q23  not placed on the board
Q24  not placed on the board
Q25  not placed on the board
Q26  not placed on the board
Q27  not placed on the board
Q28  not placed on the board
Q29  45.3,61 0 top
Q30  34.3,59 0 top
Q31  34.3,67 0 top
R1  71.7,76 0 top
R2  71.7,69.9 0 top
R3  71.7,63.8 0 top
R4  71.7,57.7 0 top
R5  71.7,51.6 0 top
R6  71.7,45.5 0 top
R7  61.4,89.8 0 top
R8  61.36,87.3 180 top
R9  52.7,72.1 0 top
R10  63.3,95 180 bottom
R11  not placed on the board
R12  not placed on the board
R13  not placed on the board
R14  60.7,81.6 0 top
R15  60.7,68.2 0 top
R16  60.7,54.8 0 top
R17  68.3,95 0 bottom
R18  78.3,95 0 bottom
R19  82.3,95 180 bottom
R20  39.7,79.7 270 top
R21  not placed on the board
R22  not placed on the board
R23  42.6,79.7 270 top
R24  54.7,62.3 0 top
R25  54.7,68.4 0 top
R26  54.7,56.2 0 top
R27  54.7,81.1 0 top
R28  not placed on the board
R29  70.7,82 0 top
R30  37,83.5 180 top
R31  not placed on the board
R32  not placed on the board
R33  not placed on the board
R34  not placed on the board
R35  not placed on the board
R36  not placed on the board
R37  not placed on the board
R38  not placed on the board
R39  39.3,62 0 top
R40  49.3,66 0 top
R41  34.3,74 0 top
R42  39.3,74 0 top
R43  44.3,74 0 top
S1  not placed on the board
SJ1  not placed on the board
SJ2  not placed on the board
SJ3  not placed on the board
SJ4  not placed on the board
SP1  188.96,54.02 0 top
U1  not placed on the board
U$1  73.47,1.27 0 top
U$2  207.8,78 180 top
U$3  207.8,64.5 180 top
U$4  207.8,51.5 180 top
U$5  208.8,92 180 top
U$6  26.3,97 0 top
U$7  54.3,44 0 top
X1  not placed on the board
X2  115.87,32.45 90 top
X3  116.03,18.68 90 top
X4  115.8,4.3 0 top
X5  167.25,4.3 0 top
X6  144.5,5.1 0 top
X7  115.87,41.09 90 top
X8  not placed on the board
X9  190.2,4.5 0 top
X10  not placed on the board
X11  168.8,95.5 0 top
X12  190.3,95 0 top
X13  149.8,95 0 top
X14  116.3,75.5 90 top
X15  115.3,62.5 90 top
X16  178.8,95 0 top
X17  114.8,51 90 top
X18  204.3,39 90 top
X19  205.3,24 90 top
X20  205.8,8 90 top
X21  not placed on the board

### Tracks (layer width: path | path; a pad name or v marks a point on that pad's centre or on a via)
12_IN  (3 unrouted)
12_VOL  (2 unrouted)
+3V3  (25 unrouted)
+12V  (24 unrouted)
AD_REL1  (1 unrouted)
AD_REL2  (1 unrouted)
AD_REL3  (1 unrouted)
AD_REL4  (1 unrouted)
AD_REL5  (1 unrouted)
AD_REL6  (1 unrouted)
AD_REL7  (1 unrouted)
AUDIO1  (2 unrouted)
AUDIO2  (2 unrouted)
BOOT0  (2 unrouted)
BOOT1  (2 unrouted)
BT_MODE  (1 unrouted)
BT_POW  (1 unrouted)
BT_RX  (1 unrouted)
BT_STER  (1 unrouted)
BT_TX  (1 unrouted)
BUZZER  (1 unrouted)
C_OSC1  (2 unrouted)
C_OSC2  (2 unrouted)
CAN_POW  (1 unrouted)
CAN_RX  (1 unrouted)
CAN_TX  (1 unrouted)
CHAR_POW  (1 unrouted)
DAY_LIGHT  (1 unrouted)
FUEL_POMP  (1 unrouted)
GND  (70 unrouted)
L1  (1 unrouted)
L2  (1 unrouted)
LIGHT  (1 unrouted)
LOCK_CLOSE  (2 unrouted)
LOCK_OPEN  (2 unrouted)
M1  (1 unrouted)
M2  (1 unrouted)
MAIN_POW  (1 unrouted)
MIR_POW  (1 unrouted)
N$2  (2 unrouted)
N$3  (1 unrouted)
N$4  (2 unrouted)
N$5  (2 unrouted)
N$6  (1 unrouted)
N$7  (1 unrouted)
N$8  (1 unrouted)
N$9  (1 unrouted)
N$10  (1 unrouted)
N$11  (1 unrouted)
N$12  (1 unrouted)
N$13  (1 unrouted)
N$14  (2 unrouted)
N$15  (1 unrouted)
N$16  (2 unrouted)
N$17  (1 unrouted)
N$18  (2 unrouted)
N$19  (2 unrouted)
N$20  (1 unrouted)
N$21  (1 unrouted)
N$22  (1 unrouted)
N$23  (1 unrouted)
N$24  (1 unrouted)
N$25  (1 unrouted)
N$26  (1 unrouted)
N$27  (1 unrouted)
N$28  (1 unrouted)
N$29  (2 unrouted)
N$30  (1 unrouted)
N$31  (1 unrouted)
N$32  (1 unrouted)
N$33  (1 unrouted)
N$34  (1 unrouted)
N$35  (1 unrouted)
N$36  (1 unrouted)
N$37  (1 unrouted)
N$38  (1 unrouted)
N$39  (1 unrouted)
N$40  (2 unrouted)
N$41  (1 unrouted)
N$42  (1 unrouted)
N$43  (2 unrouted)
N$44  (2 unrouted)
N$45  (1 unrouted)
N$46  (3 unrouted)
N$47  (1 unrouted)
N$48  (1 unrouted)
N$49  (3 unrouted)
N$50  (1 unrouted)
N$51  (1 unrouted)
N$52  (2 unrouted)
N$53  (1 unrouted)
N$54  (2 unrouted)
N$55  (1 unrouted)
N$56  (2 unrouted)
N$57  (1 unrouted)
N$58  (2 unrouted)
N$59  (1 unrouted)
N$60  (2 unrouted)
N$61  (1 unrouted)
N$62  (2 unrouted)
N$63  (1 unrouted)
N$64  (1 unrouted)
N$65  (1 unrouted)
N$66  (2 unrouted)
N$67  (2 unrouted)
N$68  (1 unrouted)
N$69  (1 unrouted)
N$70  (1 unrouted)
N$71  (2 unrouted)
N$72  (1 unrouted)
N$73  (1 unrouted)
N$74  (2 unrouted)
N$75  (1 unrouted)
N$76  (1 unrouted)
N$77  (1 unrouted)
N$78  (2 unrouted)
N$79  (1 unrouted)
N$80  (1 unrouted)
N$81  (2 unrouted)
N$82  (1 unrouted)
N$83  (1 unrouted)
N$84  (2 unrouted)
N$85  (2 unrouted)
N$86  (2 unrouted)
N$87  (2 unrouted)
N$88  (2 unrouted)
N$89  (2 unrouted)
N$90  (2 unrouted)
N$91  (1 unrouted)
N$92  (1 unrouted)
N$93  (1 unrouted)
N$94  (1 unrouted)
N$95  (1 unrouted)
N$96  (1 unrouted)
N$97  (1 unrouted)
N$98  (1 unrouted)
N$99  (3 unrouted)
N$100  (1 unrouted)
N$101  (1 unrouted)
N$102  (via drill 1.1 pad 1.93)
  other vias: 65.2,87.3
NRST  (2 unrouted)
OSC_IN  (2 unrouted)
OSC_OUT  (2 unrouted)
RFID_CS  (1 unrouted)
RFID_INT  (1 unrouted)
RFID_MISO  (1 unrouted)
RFID_MOSI  (1 unrouted)
RFID_POW  (1 unrouted)
RFID_SCK  (1 unrouted)
SIM_POW  (1 unrouted)
SIM_RS  (1 unrouted)
SIM_RX  (1 unrouted)
SIM_TX  (1 unrouted)
SWCLK  (1 unrouted)
SWDIO  (1 unrouted)
V+  (19 unrouted)
VBAT  (1 unrouted)
VCC  (4 unrouted)
WATER  (2 unrouted)